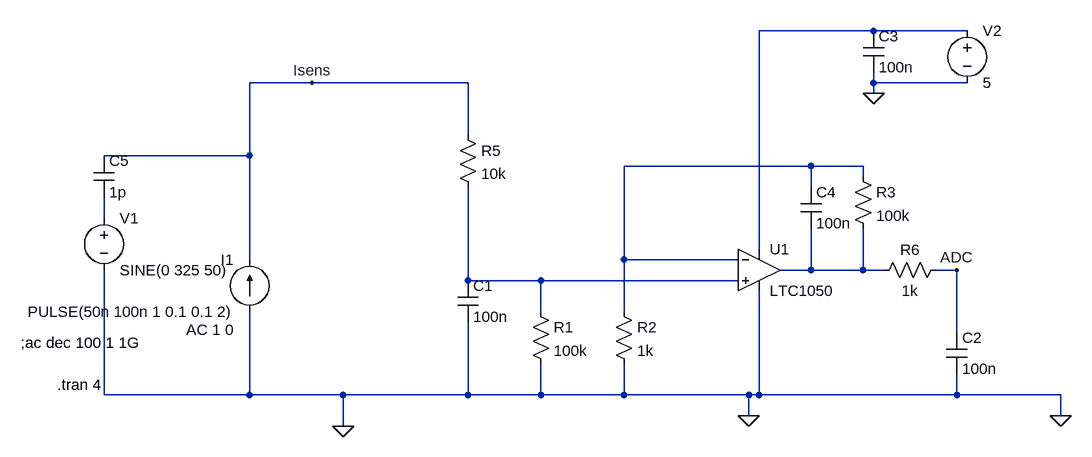
[diagram p0: schematic Draft1.asc]
Draft1.asc, the LTspice schematic file:
Version 4
SHEET 1 1092 680
WIRE 656 -176 480 -176
WIRE 800 -176 656 -176
WIRE -208 -96 -304 -96
WIRE 32 -96 -208 -96
WIRE 656 -96 656 -112
WIRE 800 -96 656 -96
WIRE 656 -80 656 -96
WIRE 32 -16 32 -96
WIRE -304 16 -304 -96
WIRE -304 16 -528 16
WIRE 560 32 272 32
WIRE 640 32 560 32
WIRE 640 48 640 32
WIRE 560 64 560 32
WIRE -528 112 -528 80
WIRE 480 160 480 -176
WIRE -304 176 -304 16
WIRE 272 176 272 32
WIRE 448 176 272 176
WIRE 560 192 560 128
WIRE 560 192 512 192
WIRE 640 192 640 128
WIRE 640 192 560 192
WIRE 672 192 640 192
WIRE 784 192 752 192
WIRE 32 208 32 64
WIRE 144 208 32 208
WIRE 448 208 144 208
WIRE 144 256 144 208
WIRE 272 256 272 176
WIRE 784 288 784 192
WIRE -528 384 -528 192
WIRE -304 384 -304 256
WIRE -304 384 -528 384
WIRE -160 384 -304 384
WIRE 32 384 32 272
WIRE 32 384 -160 384
WIRE 144 384 144 336
WIRE 144 384 32 384
WIRE 272 384 272 336
WIRE 272 384 144 384
WIRE 464 384 272 384
WIRE 480 384 480 224
WIRE 480 384 464 384
WIRE 784 384 784 352
WIRE 784 384 480 384
WIRE 944 384 784 384
WIRE 464 416 464 384
WIRE 944 416 944 384
WIRE -160 432 -160 384
FLAG -160 432 0
FLAG 464 416 0
FLAG 944 416 0
FLAG 656 -80 0
FLAG -208 -96 Isens
FLAG 784 192 ADC
SYMBOL res 128 240 R0
SYMATTR InstName R1
SYMATTR Value 100k
SYMBOL cap 16 208 R0
SYMATTR InstName C1
SYMATTR Value 100n
SYMBOL res 256 240 R0
SYMATTR InstName R2
SYMATTR Value 1k
SYMBOL OpAmps\\LTC1050 480 128 R0
SYMATTR InstName U1
SYMBOL res 624 32 R0
SYMATTR InstName R3
SYMATTR Value 100k
SYMBOL cap 768 288 R0
SYMATTR InstName C2
SYMATTR Value 100n
SYMBOL cap 640 -176 R0
SYMATTR InstName C3
SYMATTR Value 100n
SYMBOL cap 544 64 R0
SYMATTR InstName C4
SYMATTR Value 100n
SYMBOL res 16 -32 R0
SYMATTR InstName R5
SYMATTR Value 10k
SYMBOL res 768 176 R90
WINDOW 0 0 56 VBottom 2
WINDOW 3 32 56 VTop 2
SYMATTR InstName R6
SYMATTR Value 1k
SYMBOL voltage 800 -192 R0
WINDOW 123 0 0 Left 0
WINDOW 39 0 0 Left 0
SYMATTR InstName V2
SYMATTR Value 5
SYMBOL current -304 256 R180
WINDOW 0 24 80 Left 2
WINDOW 3 24 0 Left 2
WINDOW 123 24 -28 Left 2
WINDOW 39 0 0 Left 0
SYMATTR InstName I1
SYMATTR Value PULSE(50n 100n 1 0.1 0.1 2)
SYMATTR Value2 AC 1 0
SYMBOL voltage -528 96 R0
WINDOW 123 0 0 Left 0
WINDOW 39 0 0 Left 0
SYMATTR InstName V1
SYMATTR Value SINE(0 325 50)
SYMBOL cap -544 16 R0
SYMATTR InstName C5
SYMATTR Value 1p
TEXT -600 368 Left 2 !.tran 4
TEXT -656 304 Left 2 !;ac dec 100 1 1G

The netlist it stands for:
* Draft1.asc
R1 N005 0 100k
C1 N005 0 100n
R2 N002 0 1k
XU1 N005 N002 N001 0 N004 LTC1050  ; pins In+ In- V+ V- OUT
R3 N002 N004 100k
C2 ADC 0 100n
C3 N001 0 100n
C4 N002 N004 100n
R5 Isens N005 10k
R6 ADC N004 1k
V2 N001 0 5
I1 0 Isens PULSE(50n 100n 1 0.1 0.1 2) AC 1 0
V1 N003 0 SINE(0 325 50)
C5 Isens N003 1p
.tran 4
;ac dec 100 1 1G
.lib LTC.lib
.backanno
.end